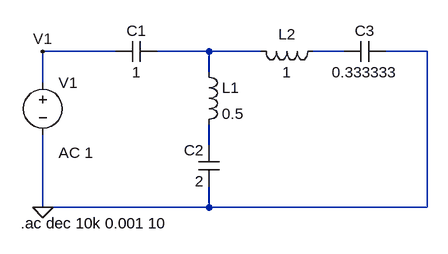
[diagram p0: schematic Punto1.asc]
Punto1.asc, the LTspice schematic file:
Version 4
SHEET 1 880 680
WIRE 64 80 -48 80
WIRE 208 80 128 80
WIRE 288 80 208 80
WIRE 416 80 368 80
WIRE 544 80 480 80
WIRE 208 112 208 80
WIRE -48 128 -48 80
WIRE 208 224 208 192
WIRE -48 320 -48 208
WIRE 208 320 208 288
WIRE 208 320 -48 320
WIRE 544 320 544 80
WIRE 544 320 208 320
FLAG -48 320 0
FLAG -48 80 V1
SYMBOL voltage -48 112 R0
WINDOW 123 24 124 Left 2
WINDOW 39 0 0 Left 0
SYMATTR InstName V1
SYMATTR Value ""
SYMATTR Value2 AC 1
SYMBOL cap 128 64 R90
WINDOW 0 0 32 VBottom 2
WINDOW 3 32 32 VTop 2
SYMATTR InstName C1
SYMATTR Value 1
SYMBOL cap 224 288 R180
WINDOW 0 24 56 Left 2
WINDOW 3 24 8 Left 2
SYMATTR InstName C2
SYMATTR Value 2
SYMBOL cap 416 96 R270
WINDOW 0 32 32 VTop 2
WINDOW 3 0 32 VBottom 2
SYMATTR InstName C3
SYMATTR Value 0.333333
SYMBOL ind 192 96 R0
SYMATTR InstName L1
SYMATTR Value 0.5
SYMBOL ind 384 64 R90
WINDOW 0 5 56 VBottom 2
WINDOW 3 32 56 VTop 2
SYMATTR InstName L2
SYMATTR Value 1
TEXT -82 344 Left 2 !.ac dec 10k 0.001 10

The netlist it stands for:
* Punto1.asc
V1 V1 0 AC 1
C1 N001 V1 1
C2 0 N003 2
C3 N002 0 0.333333
L1 N001 N003 0.5
L2 N002 N001 1
.ac dec 10k 0.001 10
.backanno
.end